# EAGLE schematic wio_shield (EAGLE 7.6.0)
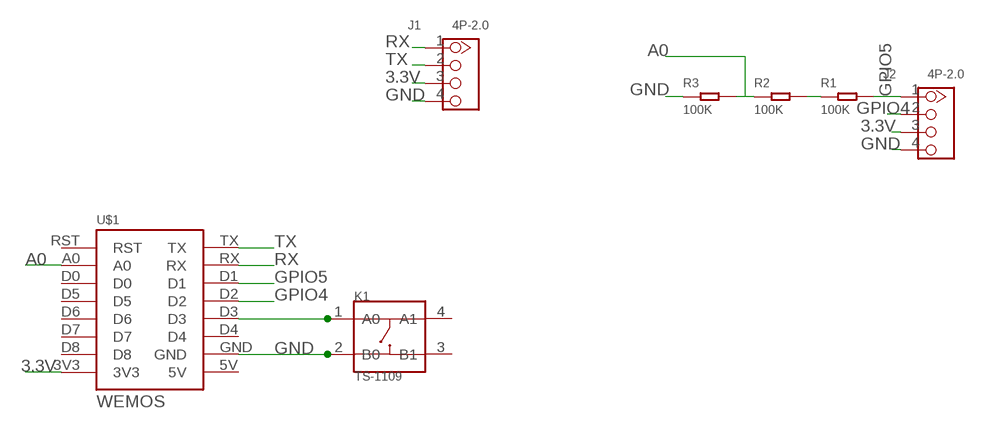
[diagram p0: schematic, sheet 1]

## Parts
J1  4P-2.0  GROVE-CONNECTOR-DIP(4P-2.0)  [HW4-2.0]
J2  4P-2.0  GROVE-CONNECTOR-DIP(4P-2.0)  [HW4-2.0]
K1  TS-1109  DIP-BUTTON-4P  [SW4-6.0X6.0X5.0MM]
R1  100K  DIP-RES-100K-5%-1/6W(PR-D1.8XL3.3MM)  [PR-D1.8*L3.3MM]
R2  100K  DIP-RES-100K-5%-1/6W(PR-D1.8XL3.3MM)  [PR-D1.8*L3.3MM]
R3  100K  DIP-RES-100K-5%-1/6W(PR-D1.8XL3.3MM)  [PR-D1.8*L3.3MM]
U$1  WEMOS  [WEMOS]

## Nets
3.3V: J1.3 J2.3 U$1.3V3
A0: R2.6 R3.5 U$1.A0
GND: J1.4 J2.4 K1.2(B0) R3.6 U$1.GND
GPIO4: J2.2 U$1.D2
GPIO5: J2.1 R1.5 U$1.D1
N$1: R1.6 R2.5
N$2: K1.1(A0) U$1.D3
RX: J1.1 U$1.RX
TX: J1.2 U$1.TX
Unconnected: K1.3(B1) K1.4(A1) U$1.5V U$1.D0 U$1.D4 U$1.D5 U$1.D6 U$1.D7 U$1.D8 U$1.RST

## Library data of the parts
J1 J2 = Seeed-Connector -2016:GROVE-CONNECTOR-DIP(4P-2.0): 320110033
K1 = Seeed-OPL-Button:DIP-BUTTON-4P: 311020024; MPN: TS-1109
R1-R3 = Seeed-OPL-Resistor:DIP-RES-100K-5%-1/6W(PR-D1.8XL3.3MM): 301020040; MPN: FHCFR-1/6W-104J--
U$1 = 1455413453956-wemos:WEMOS